# Altium schematic sheet LGT Mini Box.schdoc
size 293 x 182 mm
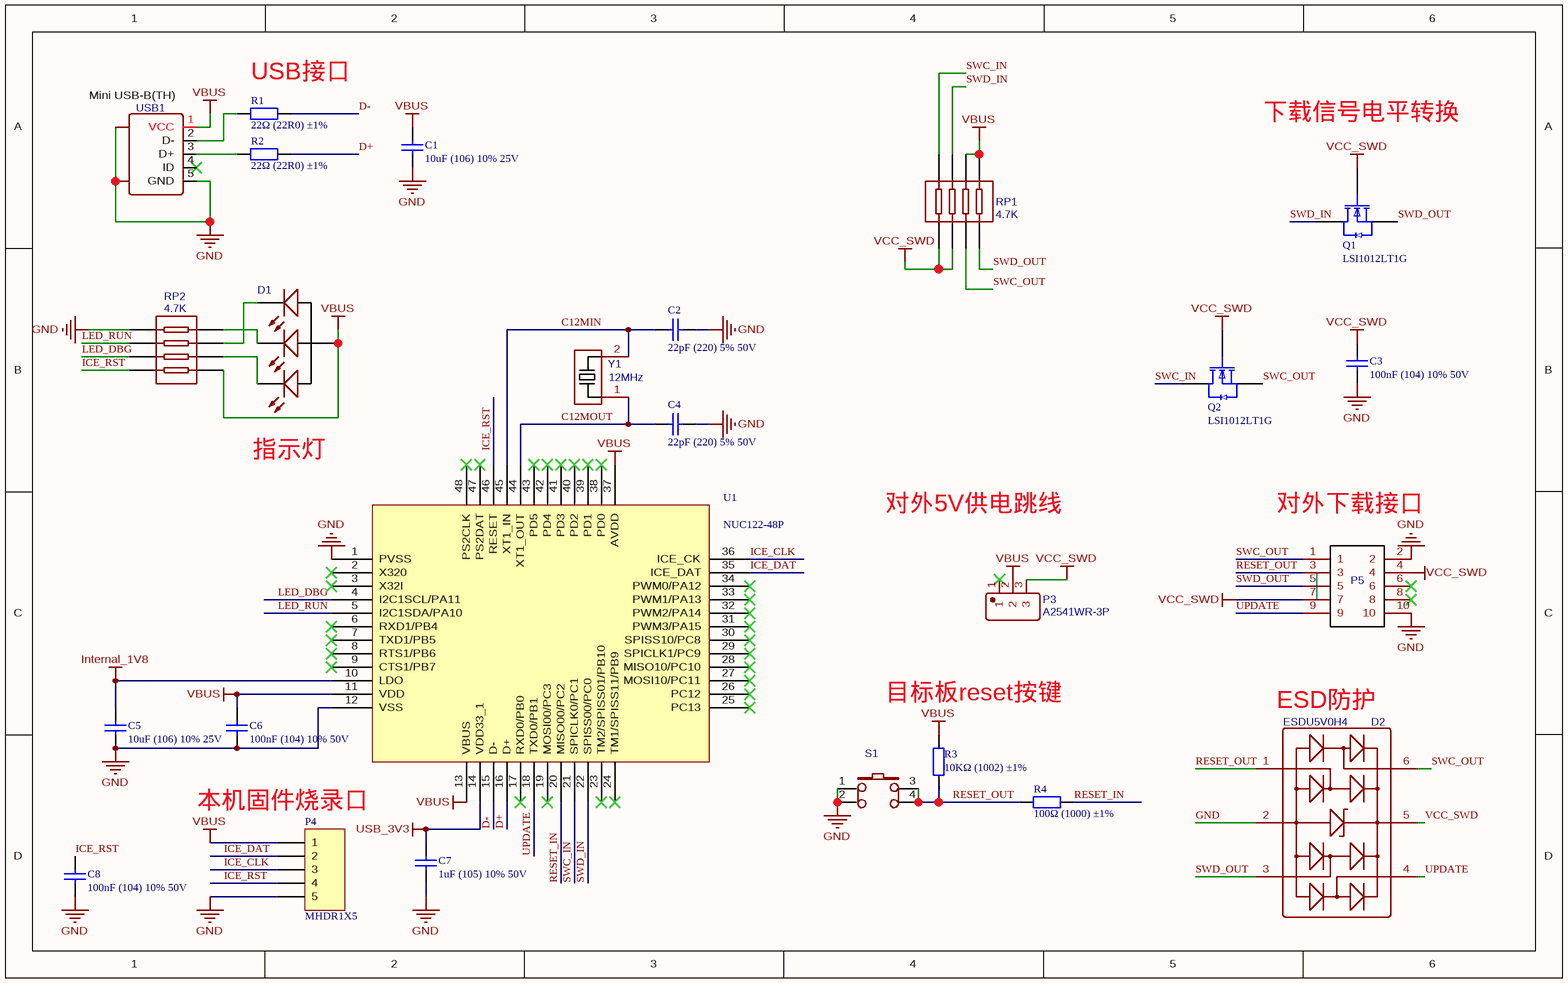
[diagram p0: LGT Mini Box.schdoc]

## Parts
C1  10uF (106) 10% 25V  [C0603]
C2  22pF (220) 5% 50V  [C0603]
C3  100nF (104) 10% 50V  [C0603]
C4  22pF (220) 5% 50V  [C0603]
C5  10uF (106) 10% 25V  [C0603]
C6  100nF (104) 10% 50V  [C0603]
C7  1uF (105) 10% 50V  [C0603]
C8  100nF (104) 10% 50V  [C0603]
D1  FM-B2020RGBA-HG  [LED-2020_4P]  (value not drawn)
D2  ESDU5V0H4  [SOT-23-6L_6PIN_L3.02-W2.95-PITCH0.95-BR]
P3  A2541WR-3P  [SIP-2.54MM-3P-CJT-H2.54]
P4  MHDR1X5  [DIP-1X5P-2.54MM-M_A]
P5  LGT-Link-2.54-2X5P  [CARHEADER5X2-A]  (value not drawn)
Q1  LSI1012LT1G  [SOT-23-3]
Q2  LSI1012LT1G  [SOT-23-3]
R1  22Ω (22R0) ±1%  [R0603]
R2  22Ω (22R0) ±1%  [R0603]
R3  10KΩ (1002) ±1%  [R0603]
R4  100Ω (1000) ±1%  [R0603]
RP1  4.7K  [0603_X4]
RP2  4.7K  [0603_X4]
S1  K2-1109DP-I4SW-01  [KEY-TOUCH-DIP-4.5X4.5XH]  (value not drawn)
U1  NUC122-48P  [LQFP-48_L7.0-W7.0-P0.5-LS9.0-BL]
USB1  Mini USB-B 5P-Female-TH_C46398  [USB-MINI-2-A]  (value not drawn)
Y1  12MHz  [OSC-49S-1-AK2]

## Nets
GND: C1.1 C2.2 C3.1 C4.2 C5.1 C6.1 C7.1 C8.1 D2.2(GND) P4.5 P5.2 P5.10 RP2.1 S1.1 S1.2 U1.1(PVSS) U1.12(VSS) USB1.0 USB1.5(GND)
Internal_1V8: C5.2 U1.10(LDO)
USB_3V3: C7.2 U1.14(VDD33_1)
VBUS: C1.2 C6.2 D1.3(A) P3.2 P4.1 R3.2 RP1.5 RP1.6 RP2.5 U1.11(VDD) U1.13(VBUS) U1.37(AVDD) USB1.1(VCC)
VCC_SWD: C3.2 D2.5(VCC) P3.3 P5.4 P5.7 Q1.1(G) Q2.1(G) RP1.1 RP1.2
C12MIN: C2.1 U1.45(XT1_IN) Y1.2
C12MOUT: C4.1 U1.44(XT1_OUT) Y1.1
D+: R2.2 U1.16(D+)
D-: R1.2 U1.15(D-)
ICE_CLK: P4.3 U1.36(ICE_CK)
ICE_DAT: P4.2 U1.35(ICE_DAT)
ICE_RST: C8.2 P4.4 RP2.4 U1.46(RESET)
LED_DBG: RP2.3 U1.4(I2C1SCL/PA11)
LED_RUN: RP2.2 U1.5(I2C1SDA/PA10)
RESET_IN: R4.1 U1.20(MISO00/PC2)
RESET_OUT: D2.1(IO1) P5.3 R3.1 R4.2 S1.3 S1.4
SWC_IN: Q2.3(D) RP1.8 U1.21(SPICLK0/PC1)
SWC_OUT: D2.6(IO2) P5.1 Q2.2(S) RP1.3
SWD_IN: Q1.3(D) RP1.7 U1.22(SPISS00/PC0)
SWD_OUT: D2.3(IO3) P5.5 Q1.2(S) RP1.4
UPDATE: D2.4(IO4) P5.9 U1.18(TXD0/PB1)
NetD1_1: D1.1(K) RP2.6
NetD1_2: D1.2(K) RP2.8
NetD1_4: D1.4(K) RP2.7
NetR1_1: R1.1 USB1.2(D-)
NetR2_1: R2.1 USB1.3(D+)

Not connected (* = marked no-connect by the designer): P3 1*; P5 6* 8*; U1 2(X320)* 3(X32I)* 6(RXD1/PB4)* 7(TXD1/PB5)* 8(RTS1/PB6)* 9(CTS1/PB7)* 17(RXD0/PB0)* 19(MOSI00/PC3)* 23(TM2/SPISS01/PB10)* 24(TM1/SPISS11/PB9)* 25(PC13)* 26(PC12)* 27(MOSI10/PC11)* 28(MISO10/PC10)* 29(SPICLK1/PC9)* 30(SPISS10/PC8)* 31(PWM3/PA15)* 32(PWM2/PA14)* 33(PWM1/PA13)* 34(PWM0/PA12)* 38(PD0)* 39(PD1)* 40(PD2)* 41(PD3)* 42(PD4)* 43(PD5)* 47(PS2DAT)* 48(PS2CLK)*; USB1 4(ID)*

## Notes on the sheet
- (near R1) USB接口
- 下载信号电平转换
- 指示灯
- 对外5V供电跳线
- (near P5) 对外下载接口
- (near R3) 目标板reset按键
- ESD防护
- 本机固件烧录口
- (in symbol Mini USB-B 5P-Female-TH_C46398) Mini USB-B(TH)

## Library data of the parts
D1 = FM-B2020RGBA-HG: BOM_Manufacturer: NATIONSTAR; Contributor: LCSC; BOM_Supplier: LCSC; BOM_Manufacturer Part: FM-B2020RGBA-HG; BOM_Supplier Part: C108793; spicePre: L
D2 = ESDU5V0H4: BOM_Manufacturer: CJ; SMT Type: Extend; BOM_Supplier: LCSC; BOM_Manufacturer Part: ESDU5V0H4; image: //image.lceda.cn/szlcsc/C84837.jpg; BOM_Supplier Part: C84837; BOM_LCSC Assembly: Yes; spicePre: D
P3 = A2541WR-3P: BOM_Manufacturer: Changjiang Connectors; Contributor: LCSC; BOM_Supplier: LCSC; BOM_Supplier Part: C225489; BOM_Manufacturer Part: A2541WR-3P; spicePre: H
P5 = LGT-Link-2.54-2X5P: BOM_Manufacturer: ReliaPro; BOM_Manufacturer Part: IDC Box 2.54mm 2X5P; BOM_Supplier: LCSC; spicePre: P; BOM_Supplier Part: C5665
RP1 RP2 = 4.7K: BOM_Manufacturer: UniOhm; BOM_Manufacturer Part: 4D03WGJ0472T5E; nameAlias: Resistance (Ohms); SMT Type: Basic; BOM_Supplier: LCSC; BOM_LCSC Assembly: Yes; BOM_Supplier Part: C1980; spicePre: R; spiceSymbolName: 4D03WGJ0472T5E
S1 = K2-1109DP-I4SW-01: BOM_Manufacturer: Korean Hroparts Elec; Contributor: LCSC; BOM_Supplier: LCSC; BOM_Supplier Part: C223802; BOM_Manufacturer Part: K2-1109DP-I4SW-01; spicePre: S
U1 = NUC122-48P: Package Display: No
USB1 = Mini USB-B 5P-Female-TH_C46398: BOM_Manufacturer: ValuePro; BOM_Manufacturer Part: MINI 5PFemale90Degree plate four feet copper shell LCPVinyl; BOM_Supplier: LCSC; image: //image.lceda.cn/szlcsc/C46398.jpg; BOM_Supplier Part: C46398; spicePre: U
Y1 = 12MHz: BOM_Manufacturer: MuRata; BOM_Manufacturer Part: CSTCE16M0V53C-R0; nameAlias: Frequency; Contributor: costar; BOM_Supplier Part: C91584; spicePre: X; spiceSymbolName: OSC-49S
C1 C5 = 10uF (106) 10% 25V: ComponentLink1Description: 供应商链接; ComponentLink1URL: http://www.szlcsc.com/product/details_16532.html; Supplier: LC; SuppliersPartNumber: C15850
C2 C4 = 22pF (220) 5% 50V: ComponentLink1Description: 供应商链接; ComponentLink1URL: http://www.szlcsc.com/product/details_2005.html; Supplier: LC; SuppliersPartNumber: C1653
C3 C6 C8 = 100nF (104) 10% 50V: ComponentLink1Description: 供应商链接; ComponentLink1URL: http://www.szlcsc.com/product/details_15331.html; Supplier: LC; SuppliersPartNumber: C14663
C7 = 1uF (105) 10% 50V: ComponentLink1Description: 供应商链接; ComponentLink1URL: http://www.szlcsc.com/product/details_16531.html; Supplier: LC; SuppliersPartNumber: C15849
P4 = MHDR1X5: LatestRevisionDate: 17-Jul-2002; LatestRevisionNote: Re-released for DXP Platform.; Publisher: Altium Limited
Q1 Q2 = LSI1012LT1G: ComponentLink1Description: 供应商链接; ComponentLink1URL: https://item.szlcsc.com/147497.html; Supplier: LC; SuppliersPartNumber: C8545
R1 R2 = 22Ω (22R0) ±1%: ComponentLink1Description: 供应商链接; ComponentLink1URL: http://www.szlcsc.com/product/details_24078.html; Supplier: LC; SuppliersPartNumber: C23345
R3 = 10KΩ (1002) ±1%: ComponentLink1Description: 供应商链接; ComponentLink1URL: http://www.szlcsc.com/product/details_26547.html; Supplier: LC; SuppliersPartNumber: C25804
R4 = 100Ω (1000) ±1%: ComponentLink1Description: 供应商链接; ComponentLink1URL: http://www.szlcsc.com/product/details_23502.html; Supplier: LC; SuppliersPartNumber: C22775